# Altium schematic sheet MAX_M10M_PINOUT.SchDoc
size B; SheetNumber: 12; SheetTotal: 21
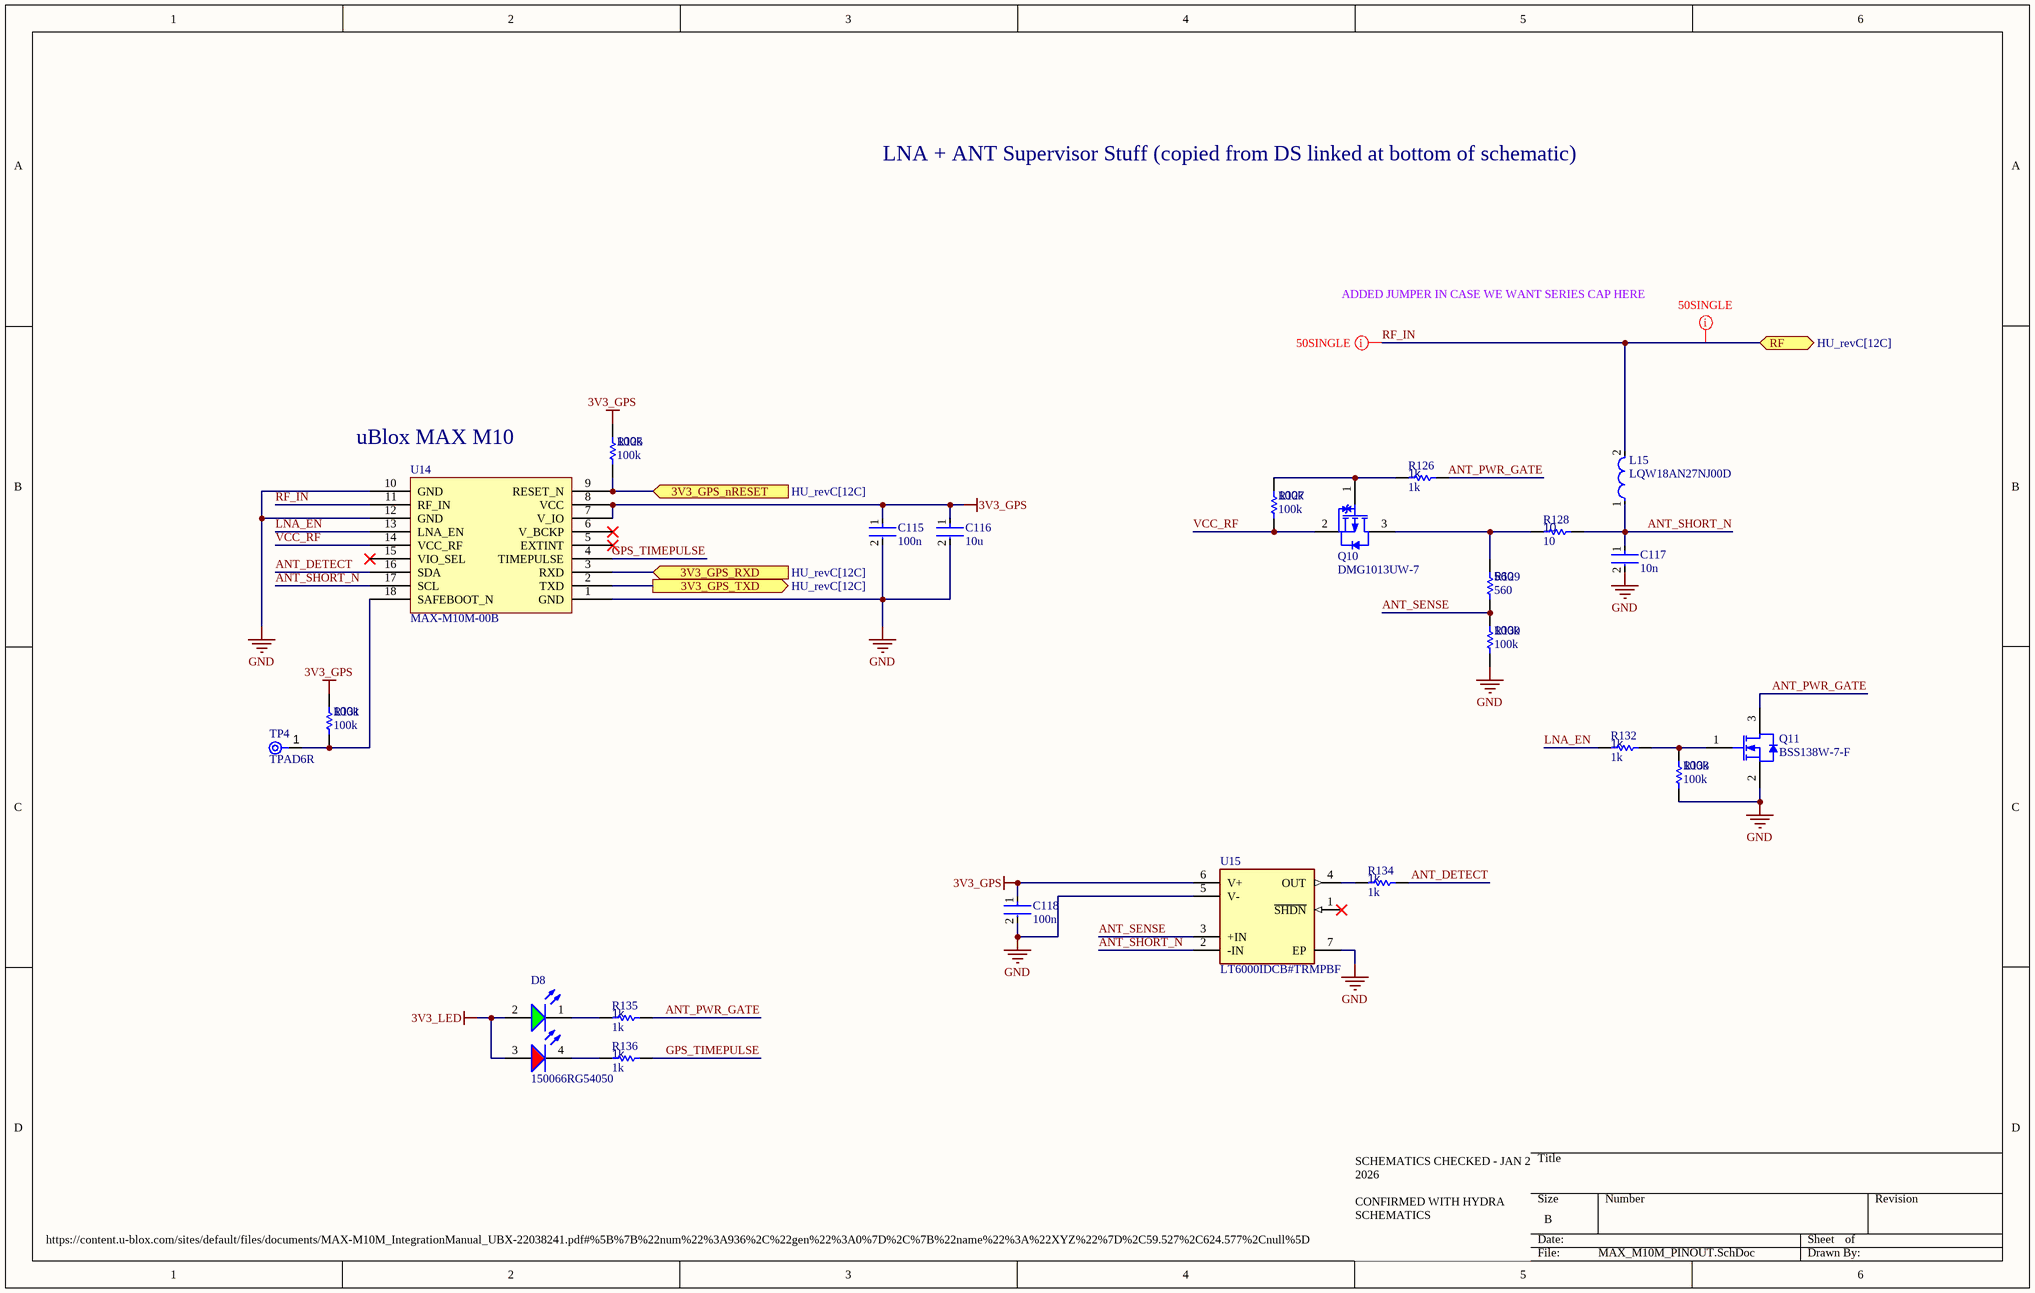
[diagram p0: MAX_M10M_PINOUT.SchDoc]

## Parts
C115  100n  [FP-0402-L_1_0_0_05-W_0_5-IPC_A]
C116  10u  [FP-0402-L_1_0_0_05-W_0_5-IPC_A]
C117  10n  [FP-0402-L_1_0_0_05-W_0_5-IPC_A]
C118  100n  [FP-0402-L_1_0_0_05-W_0_5-IPC_A]
D8  150066RG54050  [WL-SBCD_0606]
L15  LQW18AN27NJ00D  [FP-LQW18AN_00-MFG]
Q10  DMG1013UW-7  [DIOD-SOT323-3_V]
Q11  BSS138W-7-F  [DIOD-SOT323-3_V]
R125  100k  [R0603B]
R126  1k  [R0603B]
R127  100k  [R0603B]
R128  10  [R0603B]
R129  560  [R0603B]
R130  100k  [R0603B]
R131  100k  [R0603B]
R132  1k  [R0603B]
R133  100k  [R0603B]
R134  1k  [R0603B]
R135  1k  [R0603B]
R136  1k  [R0603B]
TP4  TPAD6R  [New footprint 1]
U14  MAX-M10M-00B  [MAX-M10M-00B-Footprint-1]
U15  LT6000IDCB#TRMPBF  [FP-DCB-6-05-08-1715-MFG]

## Ports
3V3_GPS_nRESET (in, see HU_revC[12C]), 3V3_GPS_RXD (in, see HU_revC[12C]), 3V3_GPS_TXD (out, see HU_revC[12C]), RF (bidir, see HU_revC[12C])

## Nets
3V3_GPS: C115.1 C116.1 C118.1 R125.1 R131.1 U14.7(V_IO) U14.8(VCC) U15.6(V+)
3V3_LED: D8.2(A) D8.3(A)
GND: C115.2 C116.2 C117.2 C118.2 Q11.2(S) R130.2 R133.2 U14.1(GND) U14.10(GND) U14.12(GND) U15.5(V-) U15.7(EP)
3V3_GPS_nRESET: R125.2 U14.9(RESET_N) ; port 3V3_GPS_nRESET
3V3_GPS_RXD: U14.3(RXD) ; port 3V3_GPS_RXD
3V3_GPS_TXD: U14.2(TXD) ; port 3V3_GPS_TXD
ANT_DETECT: R134.2 U14.16(SDA)
ANT_PWR_GATE: Q11.3(D) R126.2 R135.1
ANT_SENSE: R129.2 R130.1 U15.3(+IN)
ANT_SHORT_N: C117.1 L15.1 R128.2 U14.17(SCL) U15.2(-IN)
GPS_TIMEPULSE: R136.1 U14.4(TIMEPULSE)
LNA_EN: R132.1 U14.13(LNA_EN)
RF_IN: L15.2 U14.11(RF_IN) ; port RF
VCC_RF: Q10.2(S) R127.2 U14.14(VCC_RF)
NetD8_1: D8.1(K) R135.2
NetD8_4: D8.4(K) R136.2
NetQ10_1: Q10.1(G) R126.1 R127.1
NetQ10_3: Q10.3(D) R128.1 R129.1
NetQ11_1: Q11.1(G) R132.2 R133.1
NetR131_2: R131.2 TP4.1(TP) U14.18(SAFEBOOT_N)
NetR134_1: R134.1 U15.4(OUT)

Not connected (* = marked no-connect by the designer): U14 5(EXTINT)* 6(V_BCKP)* 15(VIO_SEL)*; U15 1(~{SHDN})*

## Layout directives
net class 50SINGLE: RF_IN

## Notes on the sheet
- LNA + ANT Supervisor Stuff (copied from DS linked at bottom of schematic)
- ADDED JUMPER IN CASE WE WANT SERIES CAP HERE
- (near U14) uBlox MAX M10
- https://content.u-blox.com/sites/default/files/documents/MAX-M10M_IntegrationManual_UBX-22038241.pdf#%5B%7B%22num%22%3A936%2C%22gen%22%3A0%7D%2C%7B%22name%22%3A%22XYZ%22%7D%2C59.527%2C624.577%2Cnull%5D
- SCHEMATICS CHECKED - JAN 2 2026
  CONFIRMED WITH HYDRA SCHEMATICS

## Library data of the parts
C115-C118 = CMP-001-00058-1: LARGE PADS, 0402 CAP, CHANGE COMMENT TO MATCH REAL P/N; Capacitor Type: Ceramic; Min Operating Temperature: -55°C; Mounting Technology: Surface Mount; Pins: 2; Case/Package: 0402; RoHS Compliant: Yes; Max Operating Temperature: 85°C
  C115 C118: Value: 100n
  C116: Value: 10u
  C117: Value: 10n
D8 = CMP-004-00040-2: Led, Red/Grn, 180Mcd/230Mcd, 624Nm/525Nm Rohs Compliant: Yes; Source: rgled.SchLib; Component Type: Standard; Design Item ID: CMP-004-00034-2; Pins: 4
L15 = CMP-06042-013840-1: Wire Wound RF Inductor 27nH ±5% 440mA 0.21Ω 0603 (1608); Shielding: Unshielded; Test Frequency: 100MHz; Q Factor: 40; Self Resonant Frequency: 3.7GHz; DC Resistance (DCR): 210mR; Core Material: Non-Magnetic; Depth: 1mm; Min Operating Temperature: -55°C; Package Quantity: 4000; Inductance: 27nH; Case Code (Metric): 1608; Height - Seated (Max): 0.039inch; Resistor Type: Wirewound; Max DC Current: 440mA; Tolerance: 5%; Length: 1.6mm; Mount: Surface Mount; DC Current: 440mA; Packaging: Tape and Reel; Lead Free: Lead Free; Case Code (Imperial): 0603; Current Rating: 440mA; Width: 0.8mm; Max Operating Temperature: 125°C; Termination: SMD/SMT; Weight: 0.000106oz; Radiation Hardening: No; Height: 0.8mm; Case/Package: 0603; Military Standard: Not
Q10 = CMP-2000-06170-1: P-Channel Enhancement Mode MOSFET, 310 mW, 20 V, -55 to 150 degC, 3-Pin SOT-323, RoHS, Tape and Reel; Manufacturer: Diodes Inc; Qg Gate Charge: 0.622nC; Drain-Source On Resistance-Max: 750mO; Rated Power Dissipation: 310mW; Drain-to-Source Voltage [Vdss]: 20V; Package Reference: SOT323; Datasheet Version: Rev. 3-2, 09/2013; Package Description: 3-Pin Small Outline Transistor, Body 2 x 1.25 mm, Pitch 0.65 mm; Mounting Technology: SurfaceMount; Manufacturer URL: http://www.diodes.com/; Datasheet URL: http://www.diodes.com/_files/datasheets/ds31861.pdf; Channel Type: P-Channel
Q11 = CMP-2000-05968-1: N-Channel Enhancement Mode Mosfet, 50 V, 200 mA, -55 to 150 degC, 6-Pin SOT-323, RoHS, Tape and Reel; Typical Turn-Off Delay Time: 20ns; Number of Channels: 1Channel; Type: EnhancementModeFieldEffectTransistor; Brand: DiodesIncorporated; Vds - Drain-Source Breakdown Voltage: 75V; Vgs - Gate-Source Voltage: 20V; Rds On - Drain-Source Resistance: 1.4Ohms; Transistor Type: 1N-Channel; Configuration: Single; Unit Weight: 0.000212oz; Pd - Power Dissipation: 200mW; Id - Continuous Drain Current: 200mA; Forward Transconductance - Min: 0.1S; Manufacturer URL: http://www.diodes.com/; Series: BSS138; Package Description: 3-Pin Small Outline Transistor, Body 2 x 1.25 mm, Pitch 0.65 mm; Mounting Technology: SurfaceMount; Product Category: MOSFET; RoHS: True; Maximum Operating Temperature: +150C; Height: 1mm; Length: 2.2mm; Technology: Si; Width: 1.35mm; Datasheet URL: http://www.diodes.com/_files/datasheets/ds30206.pdf; Manufacturer: DiodesIncorporated; Package / Case: SOT-323-3; Typical Turn-On Delay Time: 20ns; Transistor Polarity: N-Channel; Factory Pack Quantity: 3000; Packaging: Reel; Product: MOSFETSmallSignal; Datasheet Version: Rev. 11-2, 09/2013; Package Reference: SOT323; Minimum Operating Temperature: -55C; Mounting Style: SMD/SMT; Channel Mode: Enhancement
R125-R136 = CMP-009-00002-14: Resistor
  R125 R127 R130 R131 R133: Value: 100k
  R126 R132 R134-R136: Value: 1k
  R128: Value: 10
  R129: Value: 560
TP4 = CMP-00025-2: Test Point .6mm
U14 = CMP-010-00031-2: Gnss Lcc Rx Mod, Rom, Crystal
U15 = CMP-09116-000039-1: IC OPAMP GP 1 CIRCUIT 6DFN; Number of Elements: 1; Power Supply Rejection Ratio (PSRR): 86dB; Output Current per Channel: 10mA; Gain Bandwidth Product: 60kHz; Operating Supply Current: 20uA; Input Bias Current: 12nA; Voltage Gain: 120dB; Max Supply Voltage: 18V; Input Offset Voltage (Vos): 1.2mV; Min Supply Voltage: 1.8V; Slew Rate: 0.018V/µs; Common Mode Rejection Ratio: 68dB; Packaging: Tape and Reel; Mount: Surface Mount; Case/Package: DFN; Max Operating Temperature: 85°C; Number of Pins: 6; Number of Amplifiers: 1; REACH SVHC: No SVHC; Unity Gain Bandwidth Product: 60kHz; Bandwidth: 60kHz; Lead Free: Lead Free; Number of Circuits: 1; Min Operating Temperature: -40°C; Package Quantity: 1